# EAGLE design schematics (EAGLE 9.3.2)
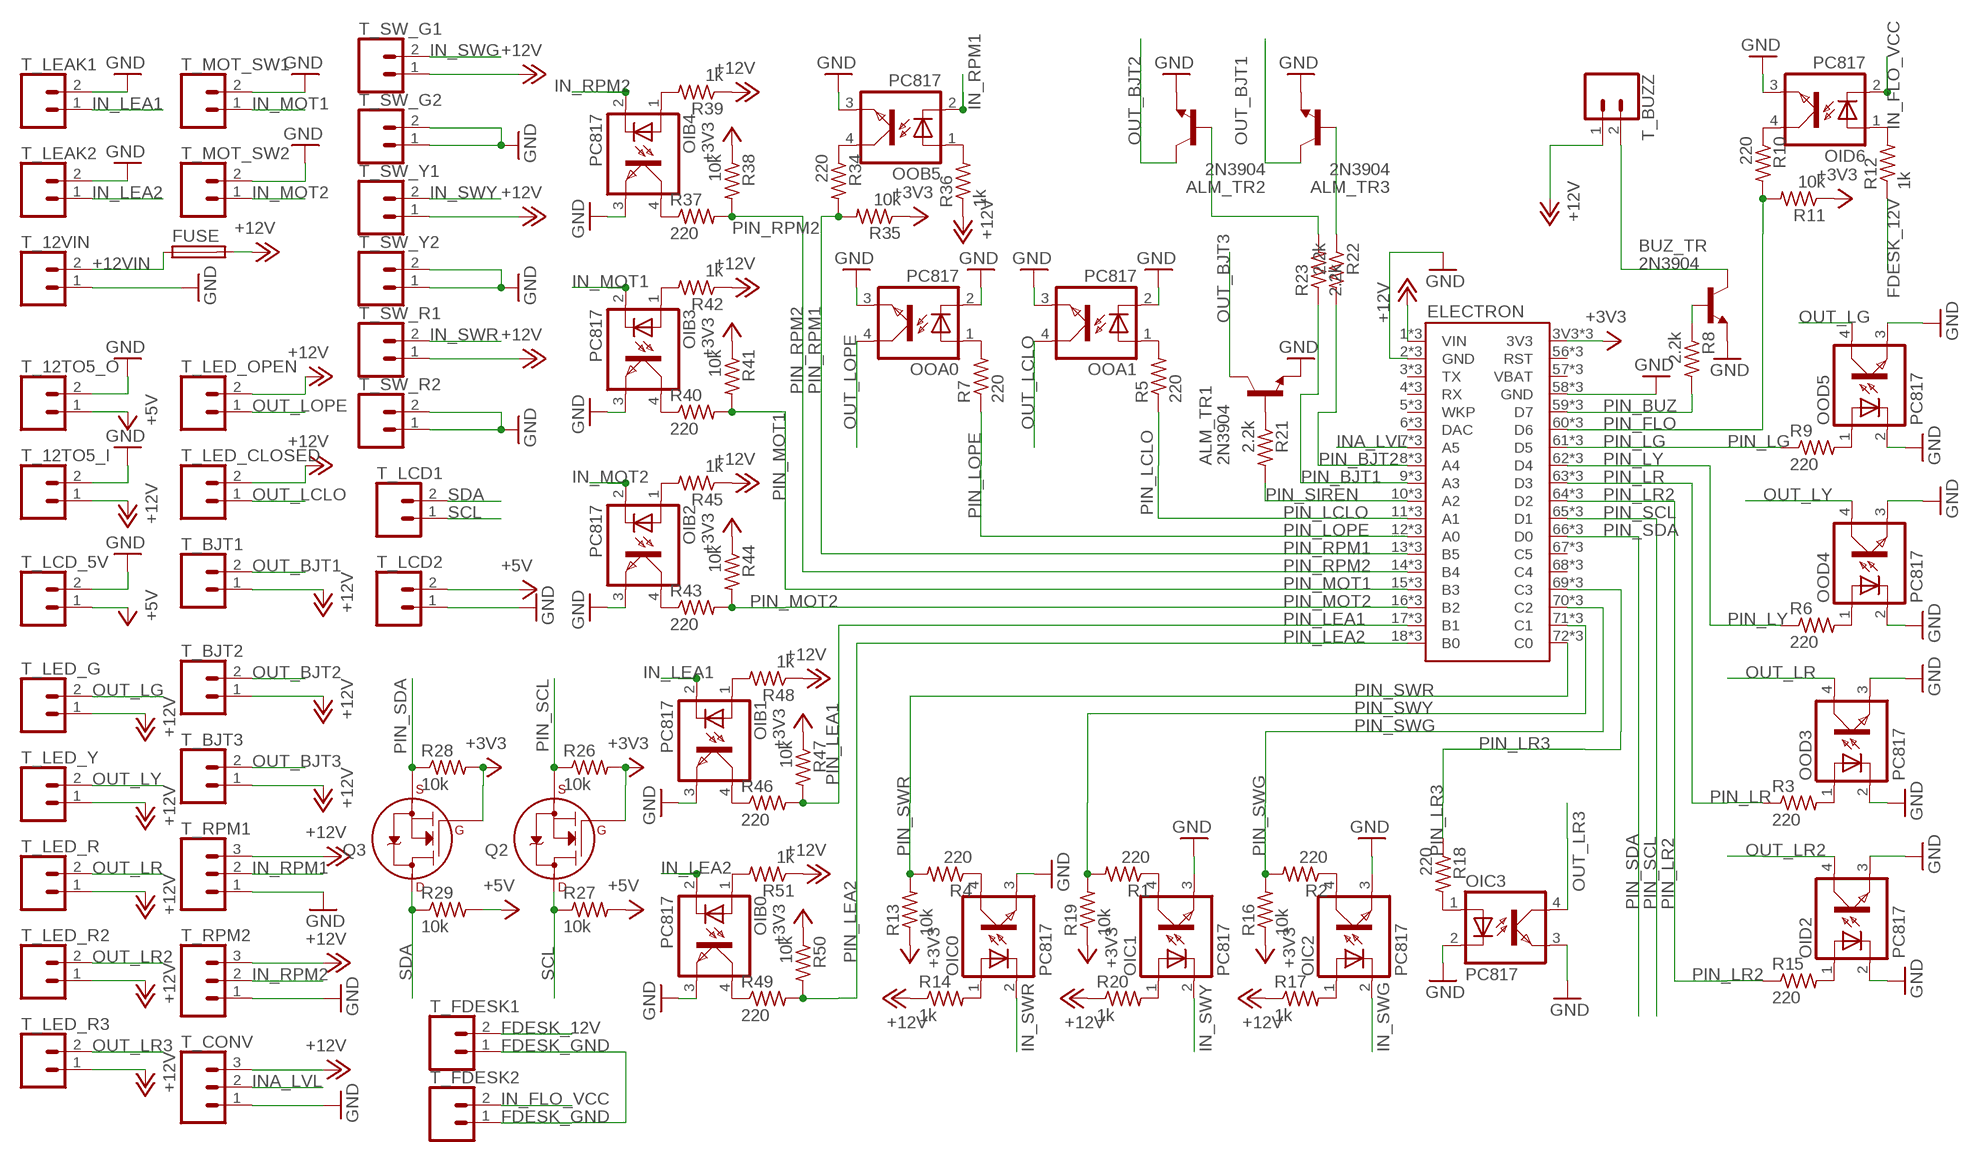
[diagram p0: schematic, sheet 1]

## Parts
ALM_TR1  2N3904  [TO92]
ALM_TR2  2N3904  [TO92]
ALM_TR3  2N3904  [TO92]
BUZ_TR  2N3904  [TO92]
ELECTRON  ELECTRONDUALROW  [ELECTRON_DUAL-ROW]
FUSE  SH25  [SH25]
OIB0  PC817  [DIL04]
OIB1  PC817  [DIL04]
OIB2  PC817  [DIL04]
OIB3  PC817  [DIL04]
OIB4  PC817  [DIL04]
OIC0  PC817  [DIL04]
OIC1  PC817  [DIL04]
OIC2  PC817  [DIL04]
OIC3  PC817  [DIL04]
OID2  PC817  [DIL04]
OID6  PC817  [DIL04]
OOA0  PC817  [DIL04]
OOA1  PC817  [DIL04]
OOB5  PC817  [DIL04]
OOD3  PC817  [DIL04]
OOD4  PC817  [DIL04]
OOD5  PC817  [DIL04]
Q2  2N7000_TO92  [TO-92]
Q3  2N7000_TO92  [TO-92]
R1  220  R-US_0207/7  [0207/7]
R2  220  R-US_0207/7  [0207/7]
R3  220  R-US_0207/7  [0207/7]
R4  220  R-US_0207/7  [0207/7]
R5  220  R-US_0207/7  [0207/7]
R6  220  R-US_0207/7  [0207/7]
R7  220  R-US_0207/7  [0207/7]
R8  2.2k  R-US_0207/7  [0207/7]
R9  220  R-US_0207/7  [0207/7]
R10  220  R-US_0207/7  [0207/7]
R11  10k  R-US_0207/7  [0207/7]
R12  1k  R-US_0207/7  [0207/7]
R13  10k  R-US_0207/7  [0207/7]
R14  1k  R-US_0207/7  [0207/7]
R15  220  R-US_0207/7  [0207/7]
R16  10k  R-US_0207/7  [0207/7]
R17  1k  R-US_0207/7  [0207/7]
R18  220  R-US_0207/7  [0207/7]
R19  10k  R-US_0207/7  [0207/7]
R20  1k  R-US_0207/7  [0207/7]
R21  2.2k  R-US_0207/7  [0207/7]
R22  2.2k  R-US_0207/7  [0207/7]
R23  2.2k  R-US_0207/7  [0207/7]
R26  10k  R-US_0207/7  [0207/7]
R27  10k  R-US_0207/7  [0207/7]
R28  10k  R-US_0207/7  [0207/7]
R29  10k  R-US_0207/7  [0207/7]
R34  220  R-US_0207/7  [0207/7]
R35  10k  R-US_0207/7  [0207/7]
R36  1k  R-US_0207/7  [0207/7]
R37  220  R-US_0207/7  [0207/7]
R38  10k  R-US_0207/7  [0207/7]
R39  1k  R-US_0207/7  [0207/7]
R40  220  R-US_0207/7  [0207/7]
R41  10k  R-US_0207/7  [0207/7]
R42  1k  R-US_0207/7  [0207/7]
R43  220  R-US_0207/7  [0207/7]
R44  10k  R-US_0207/7  [0207/7]
R45  1k  R-US_0207/7  [0207/7]
R46  220  R-US_0207/7  [0207/7]
R47  10k  R-US_0207/7  [0207/7]
R48  1k  R-US_0207/7  [0207/7]
R49  220  R-US_0207/7  [0207/7]
R50  10k  R-US_0207/7  [0207/7]
R51  1k  R-US_0207/7  [0207/7]
T_12TO5_I  CONN_025MM  [SCREWTERMINAL-5MM-2]
T_12TO5_O  CONN_025MM  [SCREWTERMINAL-5MM-2]
T_12VIN  CONN_025MM  [SCREWTERMINAL-5MM-2]
T_BJT1  CONN_025MM  [SCREWTERMINAL-5MM-2]
T_BJT2  CONN_025MM  [SCREWTERMINAL-5MM-2]
T_BJT3  CONN_025MM  [SCREWTERMINAL-5MM-2]
T_BUZZ  CONN_025MM  [SCREWTERMINAL-5MM-2]
T_CONV  CONN_03-SCREW-5MM  [SCREWTERMINAL-5MM-3]
T_FDESK1  CONN_025MM  [SCREWTERMINAL-5MM-2]
T_FDESK2  CONN_025MM  [SCREWTERMINAL-5MM-2]
T_LCD1  CONN_025MM  [SCREWTERMINAL-5MM-2]
T_LCD2  CONN_025MM  [SCREWTERMINAL-5MM-2]
T_LCD_5V  CONN_025MM  [SCREWTERMINAL-5MM-2]
T_LEAK1  CONN_025MM  [SCREWTERMINAL-5MM-2]
T_LEAK2  CONN_025MM  [SCREWTERMINAL-5MM-2]
T_LED_CLOSED  CONN_025MM  [SCREWTERMINAL-5MM-2]
T_LED_G  CONN_025MM  [SCREWTERMINAL-5MM-2]
T_LED_OPEN  CONN_025MM  [SCREWTERMINAL-5MM-2]
T_LED_R  CONN_025MM  [SCREWTERMINAL-5MM-2]
T_LED_R2  CONN_025MM  [SCREWTERMINAL-5MM-2]
T_LED_R3  CONN_025MM  [SCREWTERMINAL-5MM-2]
T_LED_Y  CONN_025MM  [SCREWTERMINAL-5MM-2]
T_MOT_SW1  CONN_025MM  [SCREWTERMINAL-5MM-2]
T_MOT_SW2  CONN_025MM  [SCREWTERMINAL-5MM-2]
T_RPM1  CONN_03-SCREW-5MM  [SCREWTERMINAL-5MM-3]
T_RPM2  CONN_03-SCREW-5MM  [SCREWTERMINAL-5MM-3]
T_SW_G1  CONN_025MM  [SCREWTERMINAL-5MM-2]
T_SW_G2  CONN_025MM  [SCREWTERMINAL-5MM-2]
T_SW_R1  CONN_025MM  [SCREWTERMINAL-5MM-2]
T_SW_R2  CONN_025MM  [SCREWTERMINAL-5MM-2]
T_SW_Y1  CONN_025MM  [SCREWTERMINAL-5MM-2]
T_SW_Y2  CONN_025MM  [SCREWTERMINAL-5MM-2]

## Nets
+3V3: ELECTRON.3V3 ELECTRON.55(3V3) ELECTRON.91(3V3) Q2.2(G) Q3.2(G) R11.1 R13.1 R16.1 R19.1 R26.2 R28.2 R35.1 R38.1 R41.1 R44.1 R47.1 R50.1
+5V: R27.2 R29.2 T_12TO5_O.1 T_LCD2.2 T_LCD_5V.1
+12V: ELECTRON.1(VIN) ELECTRON.37(VIN) ELECTRON.VIN FUSE.2 R14.1 R17.1 R20.1 R36.1 R39.1 R42.1 R45.1 R48.1 R51.1 T_12TO5_I.1 T_BJT1.1 T_BJT2.1 T_BJT3.1 T_BUZZ.1 T_CONV.3 T_LED_CLOSED.2 T_LED_G.1 T_LED_OPEN.2 T_LED_R2.1 T_LED_R3.1 T_LED_R.1 T_LED_Y.1 T_RPM1.3 T_RPM2.3 T_SW_G1.1 T_SW_R1.1 T_SW_Y1.1
+12VIN: FUSE.1 T_12VIN.2
FDESK_12V: R12.1 T_FDESK1.2
FDESK_GND: T_FDESK1.1 T_FDESK2.1
GND: ALM_TR1.3(E) ALM_TR2.3(E) ALM_TR3.3(E) BUZ_TR.3(E) ELECTRON.2(GND) ELECTRON.38(GND) ELECTRON.58(GND) ELECTRON.94(GND) ELECTRON.GND ELECTRON.GND@2(GND) OIB0.3(EMIT) OIB1.3(EMIT) OIB2.3(EMIT) OIB3.3(EMIT) OIB4.3(EMIT) OIC0.3(EMIT) OIC1.3(EMIT) OIC2.3(EMIT) OIC3.2(C) OIC3.3(EMIT) OID2.2(C) OID2.3(EMIT) OID6.3(EMIT) OOA0.2(C) OOA0.3(EMIT) OOA1.2(C) OOA1.3(EMIT) OOB5.3(EMIT) OOD3.2(C) OOD3.3(EMIT) OOD4.2(C) OOD4.3(EMIT) OOD5.2(C) OOD5.3(EMIT) T_12TO5_I.2 T_12TO5_O.2 T_12VIN.1 T_CONV.1 T_LCD2.1 T_LCD_5V.2 T_LEAK1.2 T_LEAK2.2 T_MOT_SW1.2 T_MOT_SW2.2 T_RPM1.1 T_RPM2.1 T_SW_G2.1 T_SW_G2.2 T_SW_R2.1 T_SW_R2.2 T_SW_Y2.1 T_SW_Y2.2
IN_FLO_VCC: OID6.2(C) T_FDESK2.2
IN_LEA1: OIB1.2(C) T_LEAK1.1
IN_LEA2: OIB0.2(C) T_LEAK2.1
IN_MOT1: OIB3.2(C) T_MOT_SW1.1
IN_MOT2: OIB2.2(C) T_MOT_SW2.1
IN_RPM1: OOB5.2(C) T_RPM1.2
IN_RPM2: OIB4.2(C) T_RPM2.2
IN_SWG: OIC2.2(C) T_SW_G1.2
IN_SWR: OIC0.2(C) T_SW_R1.2
IN_SWY: OIC1.2(C) T_SW_Y1.2
INA_LVL: ELECTRON.7(A5) ELECTRON.43(A5) ELECTRON.A5 T_CONV.2
N$1: OOD3.1(A) R3.2
N$2: OIC1.1(A) R20.2
N$3: OOD4.1(A) R6.2
N$4: OIC2.1(A) R17.2
N$5: OOD5.1(A) R9.2
N$7: BUZ_TR.2(B) R8.1
N$8: BUZ_TR.1(C) T_BUZZ.2
N$9: OID2.1(A) R15.2
N$10: OIC0.1(A) R14.2
N$11: OID6.1(A) R12.2
N$12: OOA1.1(A) R5.2
N$13: OID6.4(COL) R10.1
N$14: OIC0.4(COL) R4.1
N$15: OIC3.1(A) R18.2
N$16: OOA0.1(A) R7.2
N$17: OIC2.4(COL) R2.1
N$18: OIC1.4(COL) R1.1
N$19: ALM_TR1.2(B) R21.1
N$20: ALM_TR3.2(B) R22.1
N$21: ALM_TR2.2(B) R23.2
N$23: OOB5.1(A) R36.2
N$24: OOB5.4(COL) R34.1
N$25: OIB4.1(A) R39.2
N$26: OIB4.4(COL) R37.1
N$27: OIB3.1(A) R42.2
N$28: OIB3.4(COL) R40.1
N$29: OIB2.1(A) R45.2
N$30: OIB2.4(COL) R43.1
N$31: OIB1.1(A) R48.2
N$32: OIB1.4(COL) R46.1
N$33: OIB0.1(A) R51.2
N$34: OIB0.4(COL) R49.1
OUT_BJT1: ALM_TR3.1(C) T_BJT1.2
OUT_BJT2: ALM_TR2.1(C) T_BJT2.2
OUT_BJT3: ALM_TR1.1(C) T_BJT3.2
OUT_LCLO: OOA1.4(COL) T_LED_CLOSED.1
OUT_LG: OOD5.4(COL) T_LED_G.2
OUT_LOPE: OOA0.4(COL) T_LED_OPEN.1
OUT_LR: OOD3.4(COL) T_LED_R.2
OUT_LR2: OID2.4(COL) T_LED_R2.2
OUT_LR3: OIC3.4(COL) T_LED_R3.2
OUT_LY: OOD4.4(COL) T_LED_Y.2
PIN_BJT1: ELECTRON.9(A3) ELECTRON.45(A3) ELECTRON.A3 R23.1
PIN_BJT2: ELECTRON.8(A4) ELECTRON.44(A4) ELECTRON.A4 R22.2
PIN_BUZ: ELECTRON.59(D7) ELECTRON.95(D7) ELECTRON.D7 R8.2
PIN_FLO: ELECTRON.60(D6) ELECTRON.96(D6) ELECTRON.D6 R10.2 R11.2
PIN_LCLO: ELECTRON.11(A1) ELECTRON.47(A1) ELECTRON.A1 R5.1
PIN_LEA1: ELECTRON.17(B1) ELECTRON.53(B1) ELECTRON.B1 R46.2 R47.2
PIN_LEA2: ELECTRON.18(B0) ELECTRON.54(B0) ELECTRON.B0 R49.2 R50.2
PIN_LG: ELECTRON.61(D5) ELECTRON.97(D5) ELECTRON.D5 R9.1
PIN_LOPE: ELECTRON.12(A0) ELECTRON.48(A0) ELECTRON.A0 R7.1
PIN_LR: ELECTRON.63(D3) ELECTRON.99(D3) ELECTRON.D3 R3.1
PIN_LR2: ELECTRON.64(D2) ELECTRON.100(D2) ELECTRON.D2 R15.1
PIN_LR3: ELECTRON.69(C3) ELECTRON.105(C3) ELECTRON.C3 R18.1
PIN_LY: ELECTRON.62(D4) ELECTRON.98(D4) ELECTRON.D4 R6.1
PIN_MOT1: ELECTRON.15(B3) ELECTRON.51(B3) ELECTRON.B3 R40.2 R41.2
PIN_MOT2: ELECTRON.16(B2) ELECTRON.52(B2) ELECTRON.B2 R43.2 R44.2
PIN_RPM1: ELECTRON.13(B5) ELECTRON.49(B5) ELECTRON.B5 R34.2 R35.2
PIN_RPM2: ELECTRON.14(B4) ELECTRON.50(B4) ELECTRON.B4 R37.2 R38.2
PIN_SCL: ELECTRON.65(D1) ELECTRON.101(D1) ELECTRON.D1 Q2.1(S) R26.1
PIN_SDA: ELECTRON.66(D0) ELECTRON.102(D0) ELECTRON.D0 Q3.1(S) R28.1
PIN_SIREN: ELECTRON.10(A2) ELECTRON.46(A2) ELECTRON.A2 R21.2
PIN_SWG: ELECTRON.70(C2) ELECTRON.106(C2) ELECTRON.C2 R2.2 R16.2
PIN_SWR: ELECTRON.72(C0) ELECTRON.108(C0) ELECTRON.C0 R4.2 R13.2
PIN_SWY: ELECTRON.71(C1) ELECTRON.107(C1) ELECTRON.C1 R1.2 R19.2
SCL: Q2.3(D) R27.1 T_LCD1.1
SDA: Q3.3(D) R29.1 T_LCD1.2
Unconnected: ELECTRON.3(TX) ELECTRON.4(RX) ELECTRON.5(WKP) ELECTRON.6(DAC) ELECTRON.39(TX) ELECTRON.40(RX) ELECTRON.41(WKP) ELECTRON.42(DAC) ELECTRON.56(RST) ELECTRON.57(VBAT) ELECTRON.67(C5) ELECTRON.68(C4) ELECTRON.92(RST) ELECTRON.93(VBAT) ELECTRON.103(C5) ELECTRON.104(C4) ELECTRON.C4 ELECTRON.C5 ELECTRON.DAC ELECTRON.RST ELECTRON.RX ELECTRON.TX ELECTRON.VBAT ELECTRON.WKP

## Library data of the parts
ALM_TR1-ALM_TR3 BUZ_TR = transistor:2N3904: NPN TRANSISTOR
ELECTRON = Particle:ELECTRON
FUSE = fuse:SH25: FUSE HOLDER grid 25 mm, OGN0031 8211, Schurter (Buerklin); MF: SCHURTER; MPN: 0031.8211; OC_FARNELL: 1162741; OC_NEWARK: 96B9380
OIB0 OIB1-OIB4 OIC0 OIC1-OIC3 OID2 OID6 OOA0 OOA1 OOB5 OOD3-OOD5 = optocoupler:PC817: SHARP OPTO COUPLER; MPN: PC817X4J000F; OC_FARNELL: 9707727; OC_NEWARK: 97K7059
Q2 Q3 = transistors:2N700*: 2N7000, 2N7002, NDS7002A N-channel enhancement mode MOSFET
R1-R23 R26-R29 R34-R51 = resistor:R-US_: RESISTOR, American symbol
T_12TO5_I T_12TO5_O T_12VIN T_BJT1-T_BJT3 T_BUZZ T_FDESK1 T_FDESK2 T_LCD1 T_LCD2 T_LCD_5V T_LEAK1 T_LEAK2 T_LED_CLOSED T_LED_G T_LED_OPEN T_LED_R T_LED_R2 T_LED_R3 T_LED_Y T_MOT_SW1 T_MOT_SW2 T_SW_G1 T_SW_G2 T_SW_R1 T_SW_R2 T_SW_Y1 T_SW_Y2 = SparkFun-Connectors:CONN_02: Multi connection point. Often used as Generic Header-pin footprint for 0.1 inch spaced/style header connections On any of the 0.1 inch spaced packages, you can populate with these: Break Away Headers - Straight <https://www.sparkfun.com/products/116> (PRT-00116) Break Away Male Headers - Right Angle <https://www.sparkfun.com/products/553> (PRT-00553) Female Headers <https://www.sparkfun.com/products/115> (PRT-00115) Break Away Headers - Machine Pin <https://www.sparkfun.com/products/117> (PRT-00117) Break Away Female Headers - Swiss Machine Pin <https://www.sparkfun.com/products/743> (PRT-00743) For SCREWTERMINALS and SPRING TERMINALS visit here: Screw Terimnals on SparkFun.com <https://www.sparkfun.com/search/results?term=Screw+Terminals> (5mm/3.5mm/2.54mm spacing) This device is also useful as a general connection point to wire up your design to another part of your project. Our various solder wires solder well into these plated through hole pads. Hook-Up Wire - Assortment (Stranded, 22 AWG) <https://www.sparkfun.com/products/11375> (PRT-11375) Hook-Up Wire - Assortment (Solid Core, 22 AWG) <https://www.sparkfun.com/products/11367> (PRT-11367) View the entire wire category on our website here <https://www.sparkfun.com/categories/141> Special notes: Molex polarized connector foot print use with: PRT-08233 with associated crimp pins and housings. 2.54_SCREWTERM for use with PRT-10571. 3.5mm Screw Terminal footprints for PRT-08084 5mm Screw Terminal footprints for use with PRT-08432; SF_SKU: PRT-08432
T_CONV T_RPM1 T_RPM2 = SparkFun-Connectors:CONN_03: Multi connection point. Often used as Generic Header-pin footprint for 0.1 inch spaced/style header connections On any of the 0.1 inch spaced packages, you can populate with these: Break Away Headers - Straight <https://www.sparkfun.com/products/116> (PRT-00116) Break Away Male Headers - Right Angle <https://www.sparkfun.com/products/553> (PRT-00553) Female Headers <https://www.sparkfun.com/products/115> (PRT-00115) Break Away Headers - Machine Pin <https://www.sparkfun.com/products/117> (PRT-00117) Break Away Female Headers - Swiss Machine Pin <https://www.sparkfun.com/products/743> (PRT-00743) Stackable Header - 3 Pin (Female, 0.1") <https://www.sparkfun.com/products/13875> (PRT-13875) For SCREWTERMINALS and SPRING TERMINALS visit here: Screw Terimnals on SparkFun.com <https://www.sparkfun.com/search/results?term=Screw+Terminals> (5mm/3.5mm/2.54mm spacing) This device is also useful as a general connection point to wire up your design to another part of your project. Our various solder wires solder well into these plated through hole pads. Hook-Up Wire - Assortment (Stranded, 22 AWG) <https://www.sparkfun.com/products/11375> (PRT-11375) Hook-Up Wire - Assortment (Solid Core, 22 AWG) <https://www.sparkfun.com/products/11367> (PRT-11367) View the entire wire category on our website here <https://www.sparkfun.com/categories/141> Special notes: Molex polarized connector foot print use with SKU : PRT-08232 with associated crimp pins and housings.; PROD_ID: CONN-10134; SF_SKU: PRT-08433

## Board
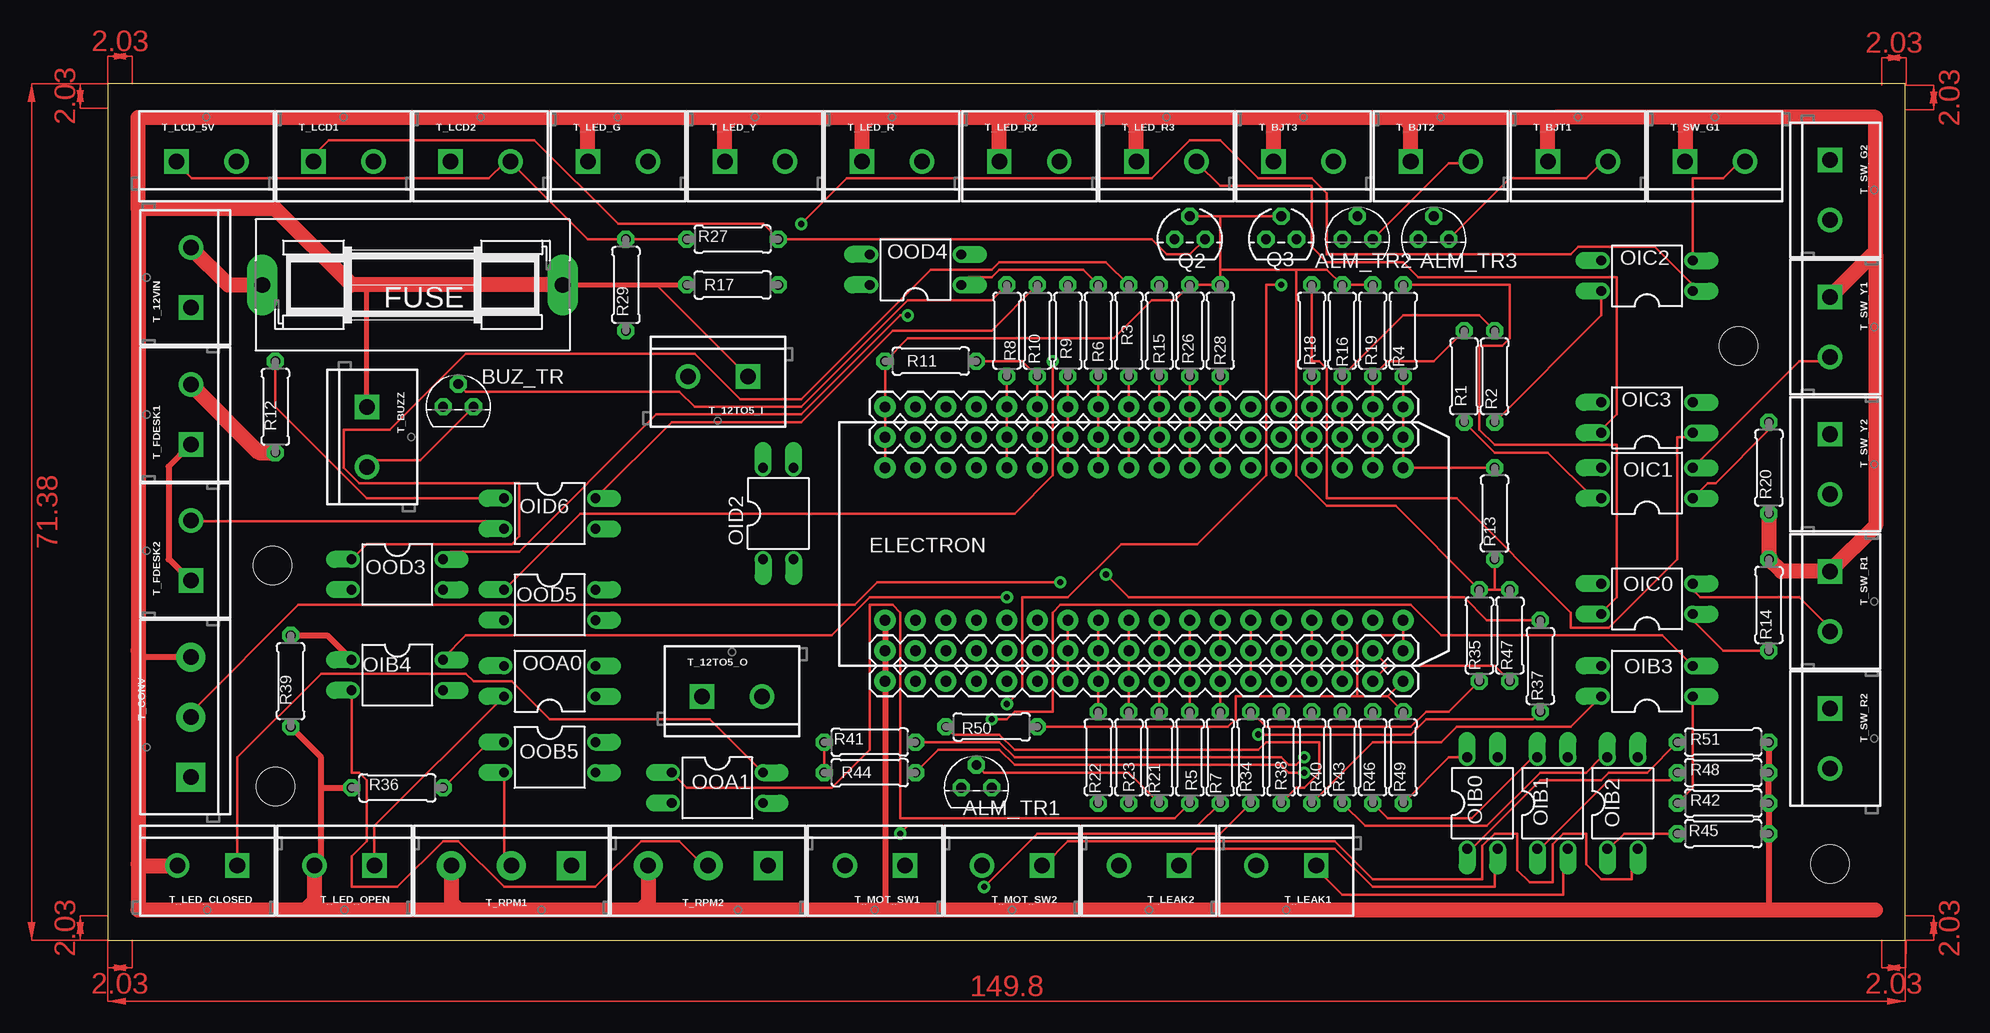
[diagram p1: board, top side]
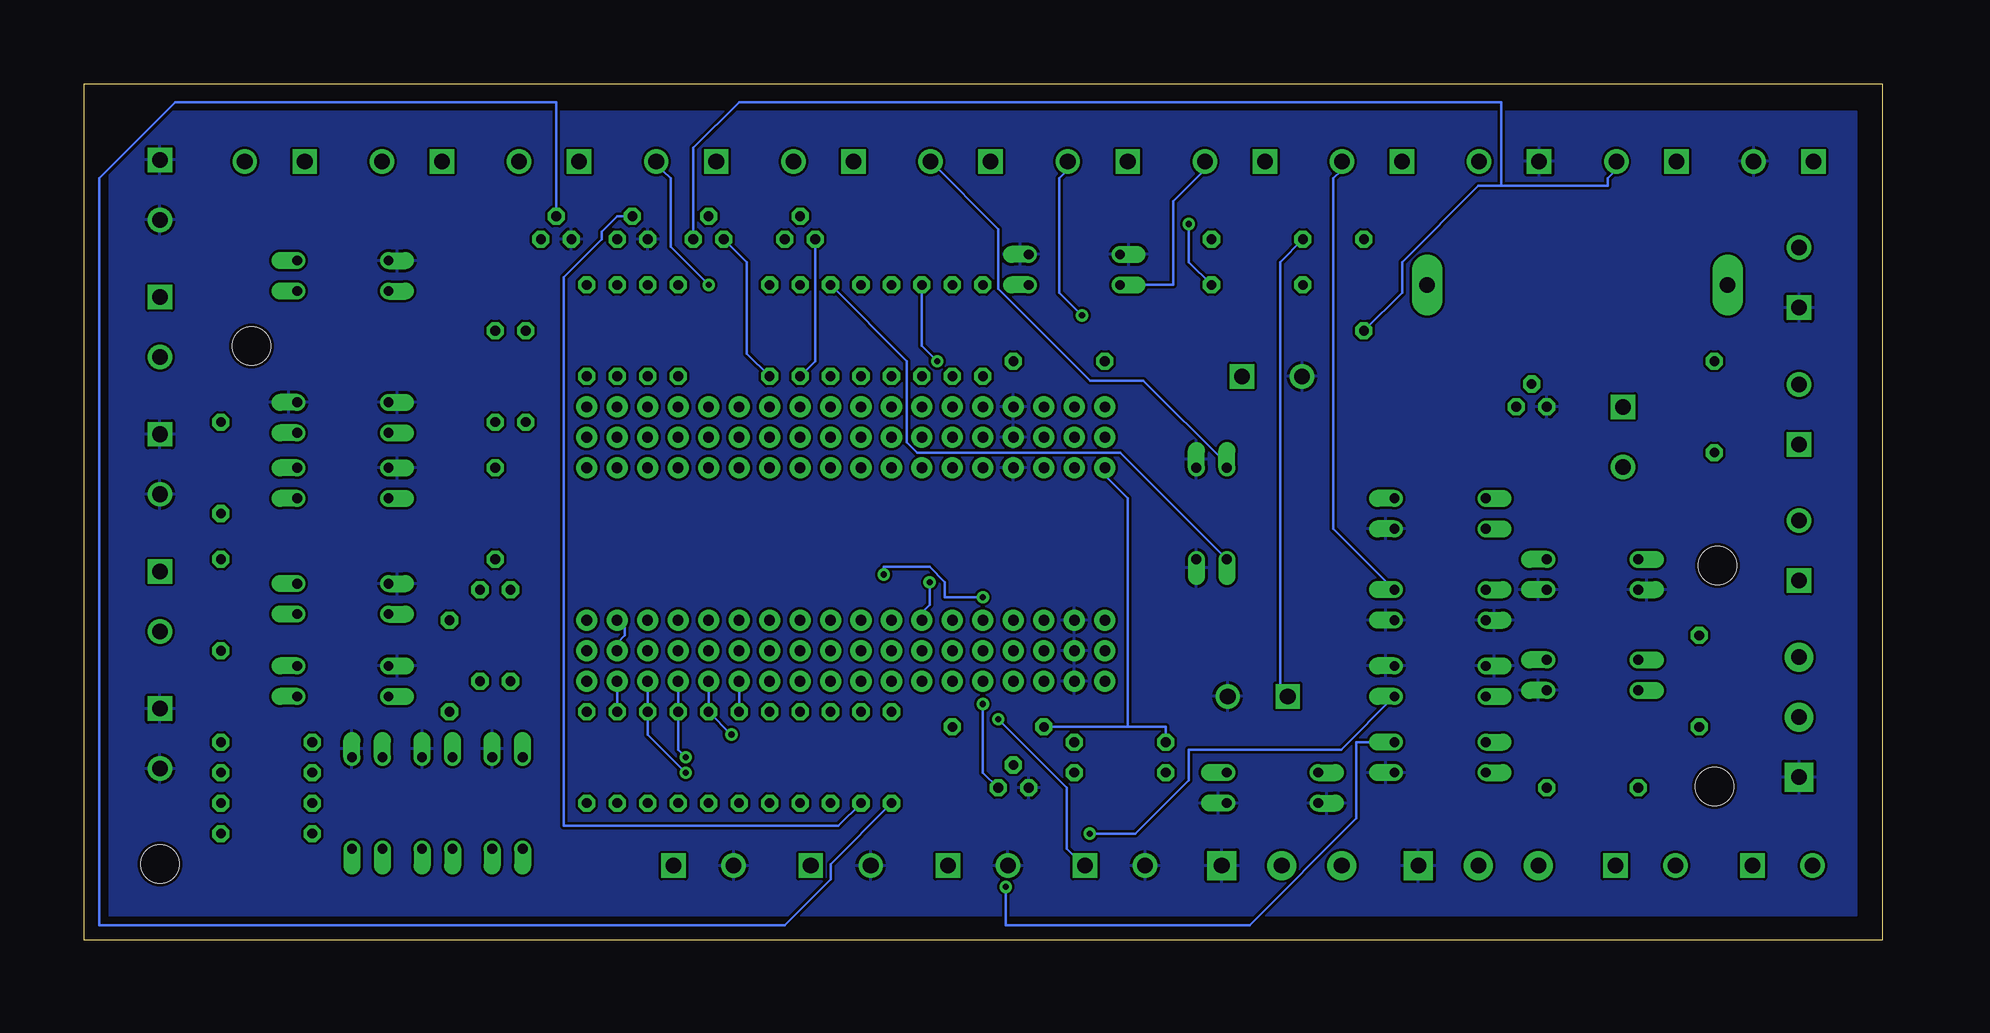
[diagram p2: board, bottom side, seen from below]

Size 149.8 x 71.38 mm. Coordinates in mm from the lower left corner, seen from the top.
Outline: 0,0 149.8,0 149.8,71.38 0,71.38 0,0
Copper layers (1*16): Top 0.035mm / dielectric 1.5mm / Bottom 0.035mm
Design rules "SparkFun": minimum track width 8mil, minimum drill 20mil, track to track 8mil, track to pad 8mil, pad to pad 8mil, via to via 8mil, smd to smd 8mil, copper to edge 10mil, drill to drill 8mil, minimum pad ring 12mil, minimum via ring 10mil, stop-mask expansion 4mil, vias tented up to drill 25mil, thermal gap 10mil
Holes 3.2 mm at 143.51,6.35 135.89,49.53 13.72,31.24 13.97,12.83

### Footprints (pad centres in the part's own frame; a part is rotated, then mirrored left to right if it is on the bottom)
TO92 = drill 0.813 octagon: 1 1.27,0; 2 0,1.905; 3 -1.27,0
ELECTRON_DUAL-ROW = drill 0.889 pad 1.753: 1 1.27,2.54; 2 3.81,2.54; 3 6.35,2.54; 3V3 1.27,22.86; 4 8.89,2.54; 5 11.43,2.54; 6 13.97,2.54; 7 16.51,2.54; 8 19.05,2.54; 9 21.59,2.54; 10 24.13,2.54; 11 26.67,2.54; 12 29.21,2.54; 13 31.75,2.54; 14 34.29,2.54; 15 36.83,2.54; 16 39.37,2.54; 17 41.91,2.54; 18 44.45,2.54; 37 1.27,7.62; 38 3.81,7.62; 39 6.35,7.62; 40 8.89,7.62; 41 11.43,7.62; 42 13.97,7.62; 43 16.51,7.62; 44 19.05,7.62; 45 21.59,7.62; 46 24.13,7.62; 47 26.67,7.62; 48 29.21,7.62; 49 31.75,7.62; 50 34.29,7.62; 51 36.83,7.62; 52 39.37,7.62; 53 41.91,7.62; 54 44.45,7.62; 55 1.27,20.32; 56 3.81,20.32; 57 6.35,20.32; 58 8.89,20.32; 59 11.43,20.32; 60 13.97,20.32; 61 16.51,20.32; 62 19.05,20.32; 63 21.59,20.32; 64 24.13,20.32; 65 26.67,20.32; 66 29.21,20.32; 67 31.75,20.32; 68 34.29,20.32; 69 36.83,20.32; 70 39.37,20.32; 71 41.91,20.32; 72 44.45,20.32; 91 1.27,25.4; 92 3.81,25.4; 93 6.35,25.4; 94 8.89,25.4; 95 11.43,25.4; 96 13.97,25.4; 97 16.51,25.4; 98 19.05,25.4; 99 21.59,25.4; 100 24.13,25.4; 101 26.67,25.4; 102 29.21,25.4; 103 31.75,25.4; 104 34.29,25.4; 105 36.83,25.4; 106 39.37,25.4; 107 41.91,25.4; 108 44.45,25.4; A0 29.21,5.08; A1 26.67,5.08; A2 24.13,5.08; A3 21.59,5.08; A4 19.05,5.08; A5 16.51,5.08; B0 44.45,5.08; B1 41.91,5.08; B2 39.37,5.08; B3 36.83,5.08; B4 34.29,5.08; B5 31.75,5.08; C0 44.45,22.86; C1 41.91,22.86; C2 39.37,22.86; C3 36.83,22.86; C4 34.29,22.86; C5 31.75,22.86; D0 29.21,22.86; D1 26.67,22.86; D2 24.13,22.86; D3 21.59,22.86; D4 19.05,22.86; D5 16.51,22.86; D6 13.97,22.86; D7 11.43,22.86; DAC 13.97,5.08; GND 8.89,22.86; GND@2 3.81,5.08; RST 3.81,22.86; RX 8.89,5.08; TX 6.35,5.08; VBAT 6.35,22.86; VIN 1.27,5.08; WKP 11.43,5.08
SH25 = drill 1.321 pad 2.54 long: 1 -12.522,0; 2 12.522,0
DIL04 = drill 0.813 offset: 1 -1.27,-3.81; 2 1.27,-3.81; 3 1.27,3.81; 4 -1.27,3.81
TO-92 = drill 0.813 octagon: 1 -1.27,0; 2 0,1.905; 3 1.27,0
0207/7 = drill 0.813 octagon: 1 -3.81,0; 2 3.81,0
SCREWTERMINAL-5MM-2 = drill 1.3 pad 2.032 square: 1 0,0 | drill 1.3 pad 2.032: 2 5,0
SCREWTERMINAL-5MM-3 = drill 1.3 pad 2.413 square: 1 0,0 | drill 1.3 pad 2.413: 2 5,0; 3 10,0

### Placement (x,y rotation side)
ALM_TR1  72.39,12.7 0 top
ALM_TR2  104.14,58.42 0 top
ALM_TR3  110.49,58.42 0 top
BUZ_TR  29.21,44.45 0 top
ELECTRON  63.5,19.05 0 top
FUSE  25.4,54.61 0 top
OIB0  114.55,11.43 0 top
OIB1  120.4,11.43 0 top
OIB2  126.24,11.43 0 top
OIB3  128.27,21.59 90 top
OIB4  24.13,22.1 270 top
OIC0  128.27,28.45 90 top
OIC1  128.27,38.1 90 top
OIC2  128.27,55.37 90 top
OIC3  128.27,43.56 90 top
OID2  55.88,35.56 0 top
OID6  36.83,35.56 270 top
OOA0  36.83,21.59 90 top
OOA1  50.8,12.7 270 top
OOB5  36.83,15.24 270 top
OOD3  24.13,30.48 270 top
OOD4  67.31,55.88 90 top
OOD5  36.83,27.94 270 top
Q2  90.17,58.42 0 top
Q3  97.79,58.42 0 top
R1  113.03,46.99 90 top
R2  115.57,46.99 90 top
R3  85.09,50.8 90 top
R4  107.95,50.8 270 top
R5  90.17,15.24 270 top
R6  82.55,50.8 90 top
R7  92.71,15.24 270 top
R8  74.93,50.8 270 top
R9  80.01,50.8 90 top
R10  77.47,50.8 270 top
R11  68.58,48.26 0 top
R12  13.97,44.45 90 top
R13  115.57,35.56 90 top
R14  138.43,27.94 270 top
R15  87.63,50.8 90 top
R16  102.87,50.8 270 top
R17  52.07,54.61 0 top
R18  100.33,50.8 90 top
R19  105.41,50.8 270 top
R20  138.43,39.37 90 top
R21  87.63,15.24 90 top
R22  82.55,15.24 90 top
R23  85.09,15.24 270 top
R26  90.17,50.8 90 top
R27  52.07,58.42 180 top
R28  92.71,50.8 90 top
R29  43.18,54.61 90 top
R34  95.25,15.24 90 top
R35  114.3,25.4 270 top
R36  24.13,12.7 0 top
R37  119.38,22.86 270 top
R38  97.79,15.24 90 top
R39  15.24,21.59 90 top
R40  100.33,15.24 90 top
R41  63.5,16.51 0 top
R42  134.62,11.43 180 top
R43  102.87,15.24 90 top
R44  63.5,13.97 0 top
R45  134.62,8.89 180 top
R46  105.41,15.24 90 top
R47  116.84,25.4 270 top
R48  134.62,13.97 180 top
R49  107.95,15.24 90 top
R50  73.66,17.78 0 top
R51  134.62,16.51 180 top
T_12TO5_I  53.34,46.99 180 top
T_12TO5_O  49.53,20.32 0 top
T_12VIN  6.92,52.72 90 top
T_BJT1  120.02,64.9 0 top
T_BJT2  108.58,64.9 0 top
T_BJT3  97.16,64.9 0 top
T_BUZZ  21.59,44.45 270 top
T_CONV  6.92,13.59 90 top
T_FDESK1  6.92,41.32 90 top
T_FDESK2  6.92,29.96 90 top
T_LCD1  17.14,64.9 0 top
T_LCD2  28.57,64.9 0 top
T_LCD_5V  5.71,64.9 0 top
T_LEAK1  100.71,6.22 180 top
T_LEAK2  89.28,6.22 180 top
T_LED_CLOSED  10.79,6.22 180 top
T_LED_G  40.01,64.9 0 top
T_LED_OPEN  22.23,6.22 180 top
T_LED_R  62.87,64.9 0 top
T_LED_R2  74.3,64.9 0 top
T_LED_R3  85.72,64.9 0 top
T_LED_Y  51.44,64.9 0 top
T_MOT_SW1  66.42,6.22 180 top
T_MOT_SW2  77.85,6.22 180 top
T_RPM1  38.64,6.22 180 top
T_RPM2  55.02,6.22 180 top
T_SW_G1  131.44,64.9 0 top
T_SW_G2  143.51,65.02 270 top
T_SW_R1  143.51,30.73 270 top
T_SW_R2  143.51,19.3 270 top
T_SW_Y1  143.51,53.59 270 top
T_SW_Y2  143.51,42.16 270 top

### Tracks (layer width: path | path; a pad name or v marks a point on that pad's centre or on a via)
+3V3
  Top 0.203: R41.1 R44.1 | R38.1 99.06,12.7 99.69,12.7 100.97,13.97 100.97,16.51 96.52,16.51 95.89,15.88 75.56,15.88 74.3,17.14 70.48,17.14 R50.1 | ELECTRON.55 ELECTRON.3V3 ELECTRON.91 R11.1 66.67,50.16 83.82,50.16 87,53.34 88.9,53.34 R26.2 R28.2 92.71,55.88 | R47.1 115.57,29.21 | 115.57,29.21 R35.1 107.31,36.2 101.6,36.2 99.06,38.73 99.06,55.88 | 115.57,29.21 R13.1 | R19.1 R16.1 101.6,55.88 99.06,55.88 | Q3.2 92.71,60.33 | 92.71,60.33 Q2.2 | 92.71,60.33 92.71,55.88 | 92.71,55.88 99.06,55.88
  Bottom 0.203: 62.87,17.78 59.69,17.78 R41.1 | 62.87,17.78 R50.1 | 62.87,17.78 62.87,36.83 64.77,38.73 ELECTRON.55
+5V
  Top 0.203: T_LCD_5V.1 5.71,64.77 6.99,63.5 31.75,63.5 33.02,64.77 T_LCD2.2 33.66,64.77 40.01,58.42 R29.2 R27.2
  Bottom 0.203: T_12TO5_O.1 50.16,20.95 50.16,56.52 R27.2
+12V
  Top 0.203: 17.78,6.35 T_LED_OPEN.2 | 45.72,54.61 T_12TO5_I.1
  Top 0.406: FUSE.2 45.72,54.61 R17.1 | T_BUZZ.1 21.59,54.61
  Top 0.508: T_LED_OPEN.2 17.78,6.78 17.78,12.7 | 17.78,12.7 R36.1 | 17.78,12.7 17.78,15.24 R39.1 | ELECTRON.37 ELECTRON.VIN ELECTRON.1 64.77,2.54 | T_CONV.3 3.08,23.59 2.54,24.13 | R51.1 R48.1 R42.1 R45.1 138.43,2.54
  Top 1.27: FUSE.2 21.59,54.61 20.32,54.61 13.97,60.96 2.54,60.96 | 2.54,60.96 2.54,68.58 39.37,68.58 | 39.37,68.58 52.07,68.58 | 52.07,68.58 63.5,68.58 | 63.5,68.58 74.93,68.58 | 74.93,68.58 85.09,68.58 | 85.09,68.58 97.79,68.58 | 97.79,68.58 107.95,68.58 | 107.95,68.58 120.65,68.58 | 132.08,68.58 147.32,68.58 147.32,57.15 | 132.08,68.58 120.65,68.58 | 2.54,60.96 2.54,24.13 2.54,6.35 | 2.54,6.35 2.54,2.54 16.51,2.54 | 16.51,2.54 29.21,2.54 | 29.21,2.54 44.45,2.54 | 44.45,2.54 64.77,2.54 138.43,2.54 147.32,2.54 | 2.54,6.35 2.67,6.22 T_LED_CLOSED.2 | T_LED_G.1 40.01,67.94 39.37,68.58 | T_LED_Y.1 51.44,67.94 52.07,68.58 | T_LED_R.1 62.87,67.94 63.5,68.58 | T_LED_R2.1 74.3,67.94 74.93,68.58 | T_LED_R3.1 85.72,67.94 85.09,68.58 | T_BJT3.1 97.16,67.94 97.79,68.58 | T_BJT2.1 108.58,67.94 107.95,68.58 | T_BJT1.1 120.02,67.94 120.65,68.58 | T_SW_Y1.1 147.07,57.15 147.32,57.15 | 132.08,68.58 131.44,67.94 T_SW_G1.1 | T_LED_OPEN.2 17.23,3.25 16.51,2.54 | T_RPM1.3 28.64,3.11 29.21,2.54 | T_RPM2.3 45.02,3.11 44.45,2.54 | 147.32,57.15 147.32,34.54 T_SW_R1.1 139.45,30.73 R14.1 R20.1
+12VIN
  Top 0.203: 6.99,57.15 T_12VIN.2
  Top 1.27: T_12VIN.2 10.03,54.61 FUSE.1
FDESK_12V
  Top 1.27: T_FDESK1.2 12.6,40.64 R12.1
FDESK_GND
  Top 0.508: T_FDESK1.1 5.08,39.48 5.08,31.75 5.14,31.75 T_FDESK2.1
GND
  pour Bottom: 2.16,69.09 2.16,2.03 147.7,2.03 147.7,69.09
IN_FLO_VCC
  Top 0.203: OID6.2 32.38,34.92 6.99,34.92 T_FDESK2.2
IN_LEA1
  Top 0.203: OIB1.2 121.28,7.62 121.28,3.81 102.87,3.81 100.97,5.71 T_LEAK1.1
IN_LEA2
  Top 0.203: OIB0.2 115.57,7.62 115.57,4.45 105.41,4.45 102.23,7.62 90.81,7.62 89.53,6.35 T_LEAK2.1
IN_MOT1  (via drill 0.51)
  Top 0.203: OIB3.2 129.54,25.4 111.12,25.4 108.58,27.94 79.38,27.94 78.74,27.3 78.74,19.05 75.56,19.05 74.93,18.41 v73.66,18.41
  Bottom 0.203: v73.66,18.41 67.94,12.7 67.94,7.62 66.67,6.35 T_MOT_SW1.1
IN_MOT2
  Top 0.203: OIB2.2 127,7.62 127,5.08 124.46,5.08 123.19,6.35 123.19,8.89 121.28,8.89 120.4,8 120.4,4.83 118.49,4.83 117.47,5.84 117.47,8.89 115.57,8.89 114.55,7.87 114.55,5.08 105.41,5.08 102.23,8.26 80.01,8.26 78.11,6.35 T_MOT_SW2.1
IN_RPM1
  Top 0.203: OOB5.2 33.02,6.35 T_RPM1.2
IN_RPM2
  Top 0.203: OIB4.2 20.32,13.97 20.95,13.97 21.59,13.34 21.59,8.26 20.32,6.99 20.32,4.45 24.13,4.45 27.94,8.26 29.21,8.26 33.02,4.45 40.64,4.45 44.45,8.26 47.62,8.26 49.53,6.35 T_RPM2.2
IN_SWG
  Top 0.203: OIC2.2 132.08,63.5 134.62,63.5 135.89,64.77 T_SW_G1.2
IN_SWR
  Top 0.203: OIC0.2 132.08,29.21 132.72,28.57 140.97,28.57 143.51,26.04 T_SW_R1.2
IN_SWY
  Top 0.203: OIC1.2 140.97,48.26 143.51,48.26 T_SW_Y1.2
INA_LVL  (via drill 0.51)
  Top 0.203: ELECTRON.7 ELECTRON.A5 ELECTRON.43 | v79.38,29.84 64.14,29.84 62.23,27.94 15.88,27.94 6.99,19.05 T_CONV.2
  Bottom 0.203: v79.38,29.84 79.38,27.94 80.01,27.3 ELECTRON.43
N$1
  Top 0.203: OOD3.1 21.59,33.02 33.66,33.02 34.29,33.66 34.29,38.1 20.95,38.1 19.68,39.37 19.68,42.55 23.5,42.55 29.84,48.9 48.9,48.9 52.7,45.09 57.78,45.09 68.58,55.88 73.66,55.88 74.3,56.52 83.19,56.52 R3.2
N$2
  Top 0.203: OIC1.1 133.35,38.1 133.99,38.1 138.43,42.55 R20.2
N$3
  Top 0.203: OOD4.1 71.75,55.24 73.66,55.24 74.3,55.88 81.28,55.88 R6.2
N$4  (via drill 0.51)
  Top 0.203: v57.78,59.69 61.59,63.5 87,63.5 90.17,66.67 92.71,66.67 95.89,63.5 100.33,63.5 101.6,62.23 101.6,57.15 121.92,57.15 122.56,57.78 128.91,57.78 132.08,54.61 OIC2.1
  Bottom 0.203: R17.2 57.78,56.52 v57.78,59.69
N$5  (via drill 0.51)
  Top 0.203: OOD5.1 39.37,35.56 75.56,35.56 78.74,38.73 v78.74,48.26
  Bottom 0.203: v78.74,48.26 80.01,49.53 R9.2
N$7
  Top 0.203: BUZ_TR.2 29.84,45.72 47.62,45.72 48.9,44.45 57.78,44.45 66.67,53.34 73.66,53.34 R8.1
N$8
  Top 0.203: BUZ_TR.1 26.04,40.01 21.59,40.01 T_BUZZ.2
N$9
  Bottom 0.203: OID2.1 63.5,40.64 80.41,40.64 81.28,41.51 81.28,48.26 R15.2
N$10
  Top 0.203: R14.2 134.62,24.13 132.08,26.67 OIC0.1
N$11
  Top 0.203: R12.2 13.97,44.45 21.59,36.83 OID6.1
N$12
  Top 0.203: OOA1.1 48.26,12.7 60.33,12.7 63.5,15.88 63.5,27.94 65.41,27.94 66.04,27.3 66.04,10.16 88.9,10.16 R5.2
N$13
  Top 0.203: OID6.4 46.99,43.18 57.78,43.18 65.41,50.8 73.66,50.8 R10.1
N$14
  Top 0.203: R4.1 116.84,54.61 116.84,50.16 116.2,49.53 114.3,49.53 114.3,42.55 115.57,41.27 125.73,41.27 125.73,28.57 124.46,27.3 OIC0.4
N$15
  Top 0.203: R18.2 100.33,48.26 100.97,48.26 101.6,47.62 101.6,36.83 112.39,36.83 121.92,27.3 121.92,26.04 125.09,26.04 130.81,31.75 130.81,41.91 132.08,41.91 OIC3.1
N$16  (via drill 0.51)
  Top 0.203: v66.04,8.89 66.67,9.53 90.81,9.53 R7.2
  Bottom 0.203: OOA0.1 45.09,15.88 57.78,15.88 57.78,13.34 62.23,8.89 v66.04,8.89
N$17
  Top 0.203: R2.1 124.46,52.07 OIC2.4
N$18
  Top 0.203: R1.1 115.57,40.64 120.02,40.64 123.83,36.83 OIC1.4
N$19
  Top 0.203: ALM_TR1.2 73.03,13.97 85.09,13.97 R21.1
N$20
  Bottom 0.203: R22.1 87.63,6.35 87.63,5.08 91.44,1.27 148.59,1.27 148.59,63.5 142.24,69.85 110.49,69.85 ALM_TR3.2
N$21
  Bottom 0.203: R23.2 87,9.53 109.86,9.53 109.86,55.24 106.68,58.42 106.68,59.05 105.41,60.33 ALM_TR2.2
N$23
  Top 0.203: R36.2 31.75,16.51 OOB5.1
N$24  (via drill 0.51)
  Top 0.203: v73.03,4.45 77.47,8.89 92.71,8.89 R34.1
  Bottom 0.203: OOB5.4 43.81,16.51 43.81,10.16 52.7,1.27 73.03,1.27 v73.03,4.45
N$25
  Top 0.508: R39.2 18.29,25.4 OIB4.1
N$26  (via drill 0.51)
  Top 0.203: v74.93,28.57 63.5,28.57 60.33,25.4 29.84,25.4 27.94,23.5 OIB4.4 | v83.19,30.48 85.09,28.57 113.03,28.57 114.94,26.67 R37.1
  Bottom 0.203: v74.93,28.57 78.11,28.57 78.11,29.84 79.38,31.11 83.19,31.11 v83.19,30.48
N$27
  Top 0.203: R42.2 132.08,12.7 OIB3.1
N$28
  Top 0.203: R40.1 105.41,16.51 111.12,16.51 112.39,17.78 121.92,17.78 OIB3.4
N$29
  Top 0.203: R45.2 126.36,8.89 125.09,7.62 OIB2.1
N$30
  Top 0.203: R43.1 104.78,9.53 114.94,9.53 119.38,13.97 123.19,13.97 124.46,15.24 OIB2.4
N$31
  Top 0.203: R48.2 130.18,13.34 125.09,13.34 119.38,7.62 OIB1.1
N$32
  Top 0.203: R46.1 106.68,10.16 113.67,10.16 118.75,15.24 OIB1.4
N$33
  Top 0.203: R51.2 128.27,13.97 125.09,13.97 124.46,13.34 119.38,13.34 113.67,7.62 OIB0.1
N$34
  Top 0.203: R49.1 111.76,15.24 OIB0.4
OUT_BJT1
  Top 0.203: ALM_TR3.1 116.84,63.5 123.19,63.5 124.46,64.77 T_BJT1.2
OUT_BJT2
  Top 0.203: ALM_TR2.1 111.76,64.77 113.03,64.77 T_BJT2.2
OUT_BJT3  (via drill 0.51)
  Top 0.203: v74.93,19.68 76.2,20.95 76.2,28.57 80.01,28.57 84.45,33.02 90.81,33.02 96.52,38.73 96.52,54.61 v97.79,54.61
  Bottom 0.203: ALM_TR1.1 74.93,13.97 v74.93,19.68 | v97.79,54.61 100.97,57.78 100.97,63.5 101.6,64.14 101.6,64.77 T_BJT3.2
OUT_LCLO
  Top 0.203: OOA1.4 50.16,18.41 36.83,18.41 33.66,21.59 30.48,21.59 29.84,22.23 17.78,22.23 10.79,15.24 T_LED_CLOSED.1
OUT_LG
  Bottom 0.203: OOD5.4 45.72,34.29 45.72,63.5 45.09,64.14 45.09,64.77 T_LED_G.2
OUT_LOPE
  Top 0.203: OOA0.4 22.23,9.53 T_LED_OPEN.1
OUT_LR  (via drill 0.51)
  Top 0.203: OOD3.4 28.57,32.38 34.29,32.38 45.72,43.81 57.78,43.81 66.04,52.07 v66.67,52.07
  Bottom 0.203: v66.67,52.07 68.58,53.98 68.58,63.5 67.94,64.14 67.94,64.77 T_LED_R.2
OUT_LR2
  Bottom 0.203: 79.38,64.14 79.38,64.77 T_LED_R2.2 73.66,59.26 73.66,54.29 66.01,46.64 61.56,46.64 54.61,39.69 OID2.4
OUT_LR3
  Top 0.203: OIC3.4 124.46,42.55 125.73,43.81 125.73,55.24 109.22,55.24 107.95,56.52 101.6,56.52 100.33,57.78 100.33,62.87 92.71,62.87 90.81,64.77 T_LED_R3.2
OUT_LY
  Bottom 0.203: OOD4.4 59.05,54.61 59.05,61.59 56.52,64.14 56.52,64.77 T_LED_Y.2
PIN_BJT1
  Top 0.203: R23.1 ELECTRON.9 ELECTRON.A3 ELECTRON.45
PIN_BJT2
  Top 0.203: R22.2 ELECTRON.8 ELECTRON.A4 ELECTRON.44
PIN_BUZ
  Top 0.203: R8.2 ELECTRON.95 ELECTRON.D7 ELECTRON.59
PIN_FLO
  Top 0.203: ELECTRON.60 ELECTRON.D6 ELECTRON.96 R10.2 76.2,48.26 R11.2
PIN_LCLO
  Top 0.203: R5.1 ELECTRON.11 ELECTRON.A1 ELECTRON.47
PIN_LEA1
  Top 0.203: R47.2 115.57,22.86 106.68,22.86 | ELECTRON.B1 106.68,22.86 | 106.68,22.86 ELECTRON.17
  Bottom 0.203: ELECTRON.17 R46.2 | ELECTRON.53 104.78,26.04 104.78,25.4 105.41,24.77 ELECTRON.B1
PIN_LEA2
  Top 0.203: ELECTRON.54 107.95,25.4 | 107.95,25.4 ELECTRON.B0 | R50.2 93.34,17.78 93.98,18.41 93.98,20.32 104.14,20.32 | 106.68,20.32 104.14,20.32 | ELECTRON.18 106.68,20.32 | 106.68,20.32 R49.2 | 107.95,25.4 104.78,25.4 104.14,24.77 104.14,20.32
PIN_LG
  Top 0.203: R9.1 ELECTRON.97 ELECTRON.D5 ELECTRON.61
PIN_LOPE
  Top 0.203: R7.1 ELECTRON.12 ELECTRON.A0 ELECTRON.48
PIN_LR
  Top 0.203: R3.1 ELECTRON.99 ELECTRON.D3 ELECTRON.63
PIN_LR2
  Top 0.203: R15.1 ELECTRON.100 ELECTRON.D2 ELECTRON.64
PIN_LR3
  Top 0.203: R18.1 ELECTRON.105 ELECTRON.C3 ELECTRON.69
PIN_LY
  Top 0.203: R6.1 ELECTRON.98 ELECTRON.D4 ELECTRON.62
PIN_MOT1  (via drill 0.51)
  Top 0.203: ELECTRON.15 ELECTRON.B3 ELECTRON.51 | R41.2 74.3,16.51 75.56,15.24 97.79,15.24 98.42,14.61 99.06,14.61 v99.69,15.24
  Bottom 0.203: v99.69,15.24 100.33,15.88 R40.2 ELECTRON.15
PIN_MOT2  (via drill 0.51)
  Top 0.203: ELECTRON.16 ELECTRON.B2 ELECTRON.52 | R44.2 69.22,15.88 74.3,15.88 75.56,14.61 97.79,14.61 98.42,13.97 v99.69,13.97
  Bottom 0.203: v99.69,13.97 102.87,17.14 R43.2 ELECTRON.16
PIN_RPM1
  Top 0.203: ELECTRON.49 ELECTRON.B5 ELECTRON.13 | R35.2 111.76,19.05 109.86,19.05 108.58,17.78 96.52,17.78 R34.2
  Bottom 0.203: ELECTRON.13 R34.2
PIN_RPM2  (via drill 0.51)
  Top 0.203: ELECTRON.50 ELECTRON.B4 ELECTRON.14 | R37.2 118.75,18.41 109.86,18.41 108.58,17.14 v95.89,17.14
  Bottom 0.203: ELECTRON.14 R38.2 v95.89,17.14
PIN_SCL
  Top 0.203: ELECTRON.65 ELECTRON.D1 ELECTRON.101 R26.1
  Bottom 0.203: Q2.1 88.9,48.26 R26.1
PIN_SDA
  Top 0.203: ELECTRON.66 ELECTRON.D0 ELECTRON.102 R28.1
  Bottom 0.203: Q3.1 94.61,56.52 94.61,48.9 R28.1
PIN_SIREN
  Top 0.203: R21.2 ELECTRON.10 ELECTRON.A2 ELECTRON.46
PIN_SWG
  Top 0.203: ELECTRON.70 ELECTRON.C2 ELECTRON.106 R16.2 107.95,52.07 114.3,52.07 R2.2
PIN_SWR
  Top 0.203: R4.2 ELECTRON.108 ELECTRON.C0 ELECTRON.72 R13.2
PIN_SWY
  Top 0.203: ELECTRON.71 ELECTRON.C1 ELECTRON.107 R19.2 106.68,48.26 110.49,48.26 R1.2
SCL
  Top 0.203: Q2.3 90.17,57.15 88.27,57.15 87,58.42 R27.1 54.61,59.69 42.55,59.69 35.56,66.67 18.41,66.67 17.14,65.41 T_LCD1.1
SDA
  Bottom 0.203: R29.1 40.01,53.98 40.01,56.52 33.66,62.87 31.75,62.87 | 31.75,62.87 22.86,62.87 22.86,63.5 22.23,64.14 22.23,64.77 T_LCD1.2 | Q3.3 99.06,66.04 95.25,69.85 31.75,69.85 31.75,62.87
(copper drawn outside any net)
  shapes: Top area x10